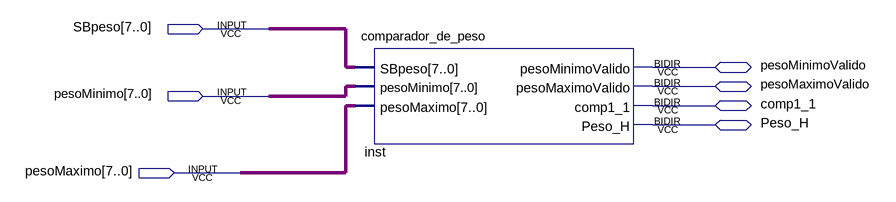
[diagram p0: schematic sheet]
// Quartus schematic bloqueComparadorPeso.bdf as structural Verilog: 1 symbols, 7 pins
module bloqueComparadorPeso (
  input  [7:0] SBpeso,
  input  [7:0] pesoMinimo,
  input  [7:0] pesoMaximo,
  inout  pesoMinimoValido,
  inout  pesoMaximoValido,
  inout  comp1_1,
  inout  Peso_H
);

  comparador_de_peso inst (
    .SBpeso(SBpeso), .pesoMinimo(pesoMinimo), .pesoMaximo(pesoMaximo), .pesoMinimoValido(pesoMinimoValido),
    .pesoMaximoValido(pesoMaximoValido), .comp1_1(comp1_1), .Peso_H(Peso_H));
endmodule
